# EAGLE design quadcopter-smith (EAGLE 7.2.0)
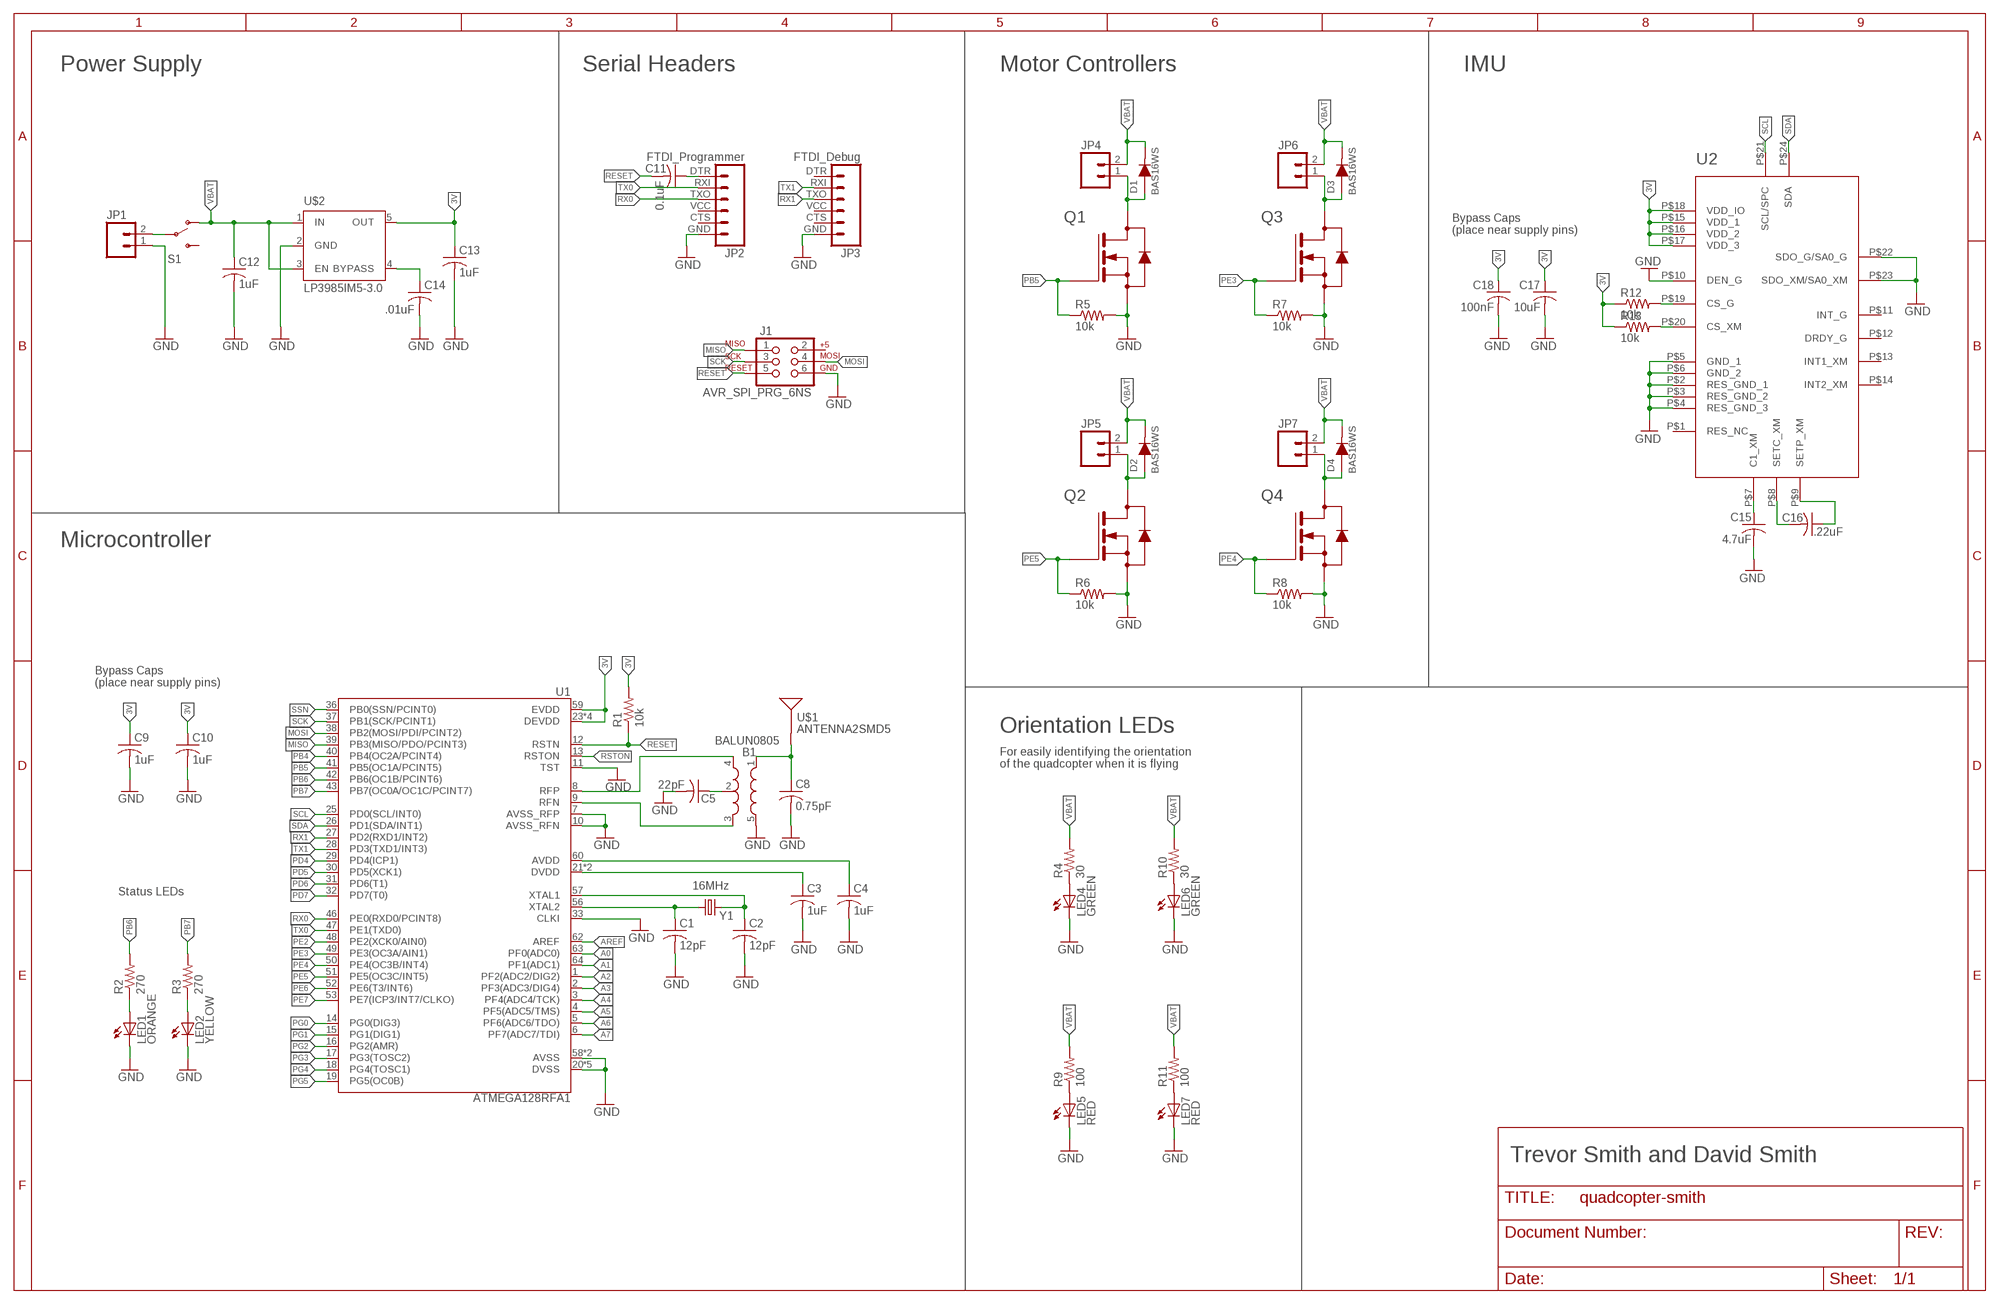
[diagram p0: schematic, sheet 1]

## Parts
B1  BALUN0805  [BALUN]
C1  12pF  C-USC0805  [C0805]
C2  12pF  C-USC0805  [C0805]
C3  1uF  C-USC0805  [C0805]
C4  1uF  C-USC0805  [C0805]
C5  22pF  C-USC0805  [C0805]
C8  0.75pF  C-USC0805  [C0805]
C9  1uF  C-USC0805  [C0805]
C10  1uF  C-USC0805  [C0805]
C11  0.1uF  C-USC0805  [C0805]
C12  1uF  C-USC0805  [C0805]
C13  1uF  C-USC0805  [C0805]
C14  .01uF  C-USC0805  [C0805]
C15  4.7uF  C-USC0805  [C0805]
C16  .22uF  C-USC0805  [C0805]
C17  10uF  C-USC0805  [C0805]
C18  100nF  C-USC0805  [C0805]
D1  BAS16WS  [SOD-323]
D2  BAS16WS  [SOD-323]
D3  BAS16WS  [SOD-323]
D4  BAS16WS  [SOD-323]
J1  AVR_SPI_PRG_6NS  [2X3-NS]
JP1  M02PTH  [1X02]
JP2  FTDI_Programmer  FTDI_BASICPTH  [FTDI_BASIC]
JP3  FTDI_Debug  FTDI_BASICPTH  [FTDI_BASIC]
JP4  M02PTH  [1X02]
JP5  M02PTH  [1X02]
JP6  M02PTH  [1X02]
JP7  M02PTH  [1X02]
LED1  ORANGE  LEDCHIP-LED0805  [CHIP-LED0805]
LED2  YELLOW  LEDCHIP-LED0805  [CHIP-LED0805]
LED4  GREEN  LEDCHIP-LED0805  [CHIP-LED0805]
LED5  RED  LEDCHIP-LED0805  [CHIP-LED0805]
LED6  GREEN  LEDCHIP-LED0805  [CHIP-LED0805]
LED7  RED  LEDCHIP-LED0805  [CHIP-LED0805]
Q1  SI2302CDS  [SOT-23]
Q2  SI2302CDS  [SOT-23]
Q3  SI2302CDS  [SOT-23]
Q4  SI2302CDS  [SOT-23]
R1  10k  R-US_R0805  [R0805]
R2  270  R-US_R0805  [R0805]
R3  270  R-US_R0805  [R0805]
R4  30  R-US_R0805  [R0805]
R5  10k  R-US_R0805  [R0805]
R6  10k  R-US_R0805  [R0805]
R7  10k  R-US_R0805  [R0805]
R8  10k  R-US_R0805  [R0805]
R9  100  R-US_R0805  [R0805]
R10  30  R-US_R0805  [R0805]
R11  100  R-US_R0805  [R0805]
R12  10k  R-US_R0805  [R0805]
R13  10k  R-US_R0805  [R0805]
S1  SWITCH-SPDTPTH  [SWITCH-SPDT]
U1  ATMEGA128RFA1  [QFN-64]
U2  LSM9DS0-LGA24  [LGA-24]
U$1  ANTENNA2SMD5  [ANTENNA-CHIP5]
U$2  LP3985IM5-3.0  [SOT23-DBV]
Y1  16MHz  CRYSTAL5X3  [CRYSTAL-SMD-5X3]

## Nets
3V: C9.1 C10.1 C13.1 C17.1 C18.1 R1.2 R12.1 R13.1 U1.23(DEVDD) U1.34(DEVDD) U1.44(DEVDD) U1.54(DEVDD) U1.59(EVDD) U2.P$15(VDD_1) U2.P$16(VDD_2) U2.P$17(VDD_3) U2.P$18(VDD_IO) U$2.5(OUT)
A0: U1.63(PF0(ADC0))
A1: U1.64(PF1(ADC1))
A2: U1.1(PF2(ADC2/DIG2))
A3: U1.2(PF3(ADC3/DIG4))
A4: U1.3(PF4(ADC4/TCK))
A5: U1.4(PF5(ADC5/TMS))
A6: U1.5(PF6(ADC6/TDO))
A7: U1.6(PF7(ADC7/TDI))
AREF: U1.62(AREF)
GND: B1.5(GND) C1.2 C2.2 C3.2 C4.2 C5.2 C8.2 C9.2 C10.2 C12.2 C13.2 C14.2 C15.2 C17.2 C18.2 J1.6 JP1.1 JP2.GND JP3.GND LED1.C LED2.C LED4.C LED5.C LED6.C LED7.C Q1.P$2(S) Q2.P$2(S) Q3.P$2(S) Q4.P$2(S) R5.2 R6.2 R7.2 R8.2 U1.7(AVSS_RFP) U1.10(AVSS_RFN) U1.11(TST) U1.20(DVSS) U1.24(DVSS) U1.33(CLKI) U1.35(DVSS) U1.45(DVSS) U1.55(DVSS) U1.58(AVSS) U1.61(AVSS) U2.P$2(RES_GND_1) U2.P$3(RES_GND_2) U2.P$4(RES_GND_3) U2.P$5(GND_1) U2.P$6(GND_2) U2.P$10(DEN_G) U2.P$22(SDO_G/SA0_G) U2.P$23(SDO_XM/SA0_XM) U$2.2(GND)
MISO: J1.1 U1.39(PB3(MISO/PDO/PCINT3))
MOSI: J1.4 U1.38(PB2(MOSI/PDI/PCINT2))
N$1: C1.1 U1.56(XTAL2) Y1.1
N$2: C2.1 U1.57(XTAL1) Y1.3
N$3: C3.1 U1.21(DVDD) U1.22(DVDD)
N$4: C4.1 U1.60(AVDD)
N$5: B1.3(OUT2) U1.9(RFN)
N$6: B1.4(OUT1) U1.8(RFP)
N$9: B1.1(IN) C8.1 U$1.FEED(SIGNAL)
N$10: B1.2(GND) C5.1
N$11 [VBAT]: D2.P$1 JP5.1 Q2.P$3(D)
N$12: LED1.A R2.1
N$13: LED2.A R3.1
N$14: LED4.A R4.1
N$15: C11.1 JP2.DTR
N$16: C14.1 U$2.4(BYPASS)
N$17: JP1.2 S1.2(P)
N$18: D1.P$1 JP4.1 Q1.P$3(D)
N$19: D3.P$1 JP6.1 Q3.P$3(D)
N$20: D4.P$1 JP7.1 Q4.P$3(D)
N$21: C16.1 U2.P$9(SETP_XM)
N$22: C16.2 U2.P$8(SETC_XM)
N$23: C15.1 U2.P$7(C1_XM)
N$24: LED6.A R10.1
N$25: LED5.A R9.1
N$26: LED7.A R11.1
N$27: R12.2 U2.P$19(CS_G)
N$28: R13.2 U2.P$20(CS_XM)
PB4: U1.40(PB4(OC2A/PCINT4))
PB5: Q1.P$1(G) R5.1 U1.41(PB5(OC1A/PCINT5))
PB6: R2.2 U1.42(PB6(OC1B/PCINT6))
PB7: R3.2 U1.43(PB7(OC0A/OC1C/PCINT7))
PD4: U1.29(PD4(ICP1))
PD5: U1.30(PD5(XCK1))
PD6: U1.31(PD6(T1))
PD7: U1.32(PD7(T0))
PE2: U1.48(PE2(XCK0/AIN0))
PE3: Q3.P$1(G) R7.1 U1.49(PE3(OC3A/AIN1))
PE4: Q4.P$1(G) R8.1 U1.50(PE4(OC3B/INT4))
PE5: Q2.P$1(G) R6.1 U1.51(PE5(OC3C/INT5))
PE6: U1.52(PE6(T3/INT6))
PE7: U1.53(PE7(ICP3/INT7/CLKO))
PG0: U1.14(PG0(DIG3))
PG1: U1.15(PG1(DIG1))
PG2: U1.16(PG2(AMR))
PG3: U1.17(PG3(TOSC2))
PG4: U1.18(PG4(TOSC1))
PG5: U1.19(PG5(OC0B))
RESET: C11.2 J1.5 R1.1 U1.12(RSTN)
RSTON: U1.13(RSTON)
RX0: JP2.TXO U1.46(PE0(RXD0/PCINT8))
RX1: JP3.TXO U1.27(PD2(RXD1/INT2))
SCK: J1.3 U1.37(PB1(SCK/PCINT1))
SCL: U1.25(PD0(SCL/INT0)) U2.P$21(SCL/SPC)
SDA: U1.26(PD1(SDA/INT1)) U2.P$24(SDA)
SSN: U1.36(PB0(SSN/PCINT0))
TX0: JP2.RXI U1.47(PE1(TXD0))
TX1: JP3.RXI U1.28(PD3(TXD1/INT3))
VBAT [VBAT]: C12.1 D1.P$2 D2.P$2 D3.P$2 D4.P$2 JP4.2 JP5.2 JP6.2 JP7.2 R4.2 R9.2 R10.2 R11.2 S1.1(O) U$2.1(IN) U$2.3(EN)
Unconnected: J1.2 JP2.CTS JP2.VCC JP3.CTS JP3.DTR JP3.VCC S1.3(S) U2.P$1(RES_NC) U2.P$11(INT_G) U2.P$12(DRDY_G) U2.P$13(INT1_XM) U2.P$14(INT2_XM)

## Notes on the sheet
- Power Supply | Serial Headers | Motor Controllers | IMU
- Bypass Caps
  (place near supply pins)
- Microcontroller
- Bypass Caps
  (place near supply pins)
- Orientation LEDs
- For easily identifying the orientation
  of the quadcopter when it is flying
- Status LEDs
- Trevor Smith and David Smith

## Library data of the parts
B1 = Lab5:BALUN: 0805 footprint balun- Ember 351/357
C1-C5 C8-C18 = Lab5:C-US: CAPACITOR, American symbol
D1-D4 = Trevor-lab4:BAS16WS; CREATOR: Trevor Smith; DIST: Digikey; DISTPN: BAS16WS-E3-08CT-ND
J1 = Lab5:AVR_SPI_PRG_6: AVR ISP 6 Pin This is the reduced ISP connector for AVR programming. Common on Arduino. This footprint will take up less PCB space and can be used with a 10-pin to 6-pin adapter such as SKU: BOB-08508
JP1 JP4-JP7 = Lab5:M02: Header 2 Standard 2-pin 0.1" header. Use with straight break away headers (SKU : PRT-00116), right angle break away headers (PRT-00553), swiss pins (PRT-00743), machine pins (PRT-00117), and female headers (PRT-00115). Molex polarized connector foot print use with SKU : PRT-08233 with associated crimp pins and housings.
JP2 JP3 = Lab5:FTDI_BASIC: FTDI Basic header with labels
LED1 LED2 LED4-LED7 = Lab5:LED: LED OSRAM: - CHIPLED LG R971, LG N971, LY N971, LG Q971, LY Q971, LO R971, LY R971 LH N974, LH R974 LS Q976, LO Q976, LY Q976 LO Q996 - Hyper CHIPLED LW Q18S LB Q993, LB Q99A, LB R99A - SideLED LS A670, LO A670, LY A670, LG A670, LP A670 LB A673, LV A673, LT A673, LW A673 LH A674 LY A675 LS A676, LA A676, LO A676, LY A676, LW A676 LS A679, LY A679, LG A679 - Hyper Micro SIDELED® LS Y876, LA Y876, LO Y876, LY Y876 LT Y87S - SmartLED LW L88C, LW L88S LB L89C, LB L89S, LG L890 LS L89K, LO L89K, LY L89K LS L896, LA L896, LO L896, LY L896 - TOPLED LS T670, LO T670, LY T670, LG T670, LP T670 LSG T670, LSP T670, LSY T670, LOP T670, LYG T670 LG T671, LOG T671, LSG T671 LB T673, LV T673, LT T673, LW T673 LH T674 LS T676, LA T676, LO T676, LY T676, LB T676, LH T676, LSB T676, LW T676 LB T67C, LV T67C, LT T67C, LS T67K, LO T67K, LY T67K, LW E67C LS E67B, LA E67B, LO E67B, LY E67B, LB E67C, LV E67C, LT E67C LW T67C LS T679, LY T679, LG T679 LS T770, LO T770, LY T770, LG T770, LP T770 LB T773, LV T773, LT T773, LW T773 LH T774 LS E675, LA E675, LY E675, LS T675 LS T776, LA T776, LO T776, LY T776, LB T776 LHGB T686 LT T68C, LB T68C - Hyper Mini TOPLED® LB M676 - Mini TOPLED Santana® LG M470 LS M47K, LO M47K, LY M47K Source: http://www.osram.convergy.de LUXEON: - LUMILED® LXK2-PW12-R00, LXK2-PW12-S00, LXK2-PW14-U00, LXK2-PW14-V00 LXK2-PM12-R00, LXK2-PM12-S00, LXK2-PM14-U00 LXK2-PE12-Q00, LXK2-PE12-R00, LXK2-PE12-S00, LXK2-PE14-T00, LXK2-PE14-U00 LXK2-PB12-K00, LXK2-PB12-L00, LXK2-PB12-M00, LXK2-PB14-N00, LXK2-PB14-P00, LXK2-PB14-Q00 LXK2-PR12-L00, LXK2-PR12-M00, LXK2-PR14-Q00, LXK2-PR14-R00 LXK2-PD12-Q00, LXK2-PD12-R00, LXK2-PD12-S00 LXK2-PH12-R00, LXK2-PH12-S00 LXK2-PL12-P00, LXK2-PL12-Q00, LXK2-PL12-R00 Source: www.luxeon.com KINGBRIGHT: KA-3528ASYC Source: www.kingbright.com
Q1-Q4 = Trevor-lab4:SI2302CDS; CREATOR: Trevor Smith; DIST: Digikey; DISTPN: SI2302CDS-T1-E3
R1-R13 = Lab5:R-US_: RESISTOR, American symbol
S1 = Lab5:SWITCH-SPDT: SPDT Switch Simple slide switch, Spark Fun Electronics SKU : COM-00102 DPDT SMT slide switch, AYZ0202, SWCH-08179; PROD_ID: SWCH-08261
U1 = Lab5:ATMEGA128RFA1: ATmega128RFA1 8-bit AVR Microcontroller with Low Power 2.4GHz Transceiver for ZigBee and IEEE 802.15.4
U2 = Trevor-lab4:LSM9DS0; CREATOR: Trevor Smith; DIST: Digikey; DISTPN: 497-13902-1-ND
U$1 = Lab5:ANTENNA2: Chip antenna Single endded antenna. Common with smaller chip antennas. CHIP4 package is the GPS Chip Antenna SKU: GPS-08418. CHIP5 package is 2.4GHz chip antenna SKU: WRL-00144.
U$2 = Lab5:LP3985IM5-3.0
Y1 = Lab5:CRYSTAL: Various standard crystals. Proven footprints. Spark Fun Electronics SKU : COM-00534

## Net classes
1 VBAT: width 0.457 mm, drill 0.457 mm
2 ANTENNA: width 0.457 mm, drill 0.457 mm

## Board
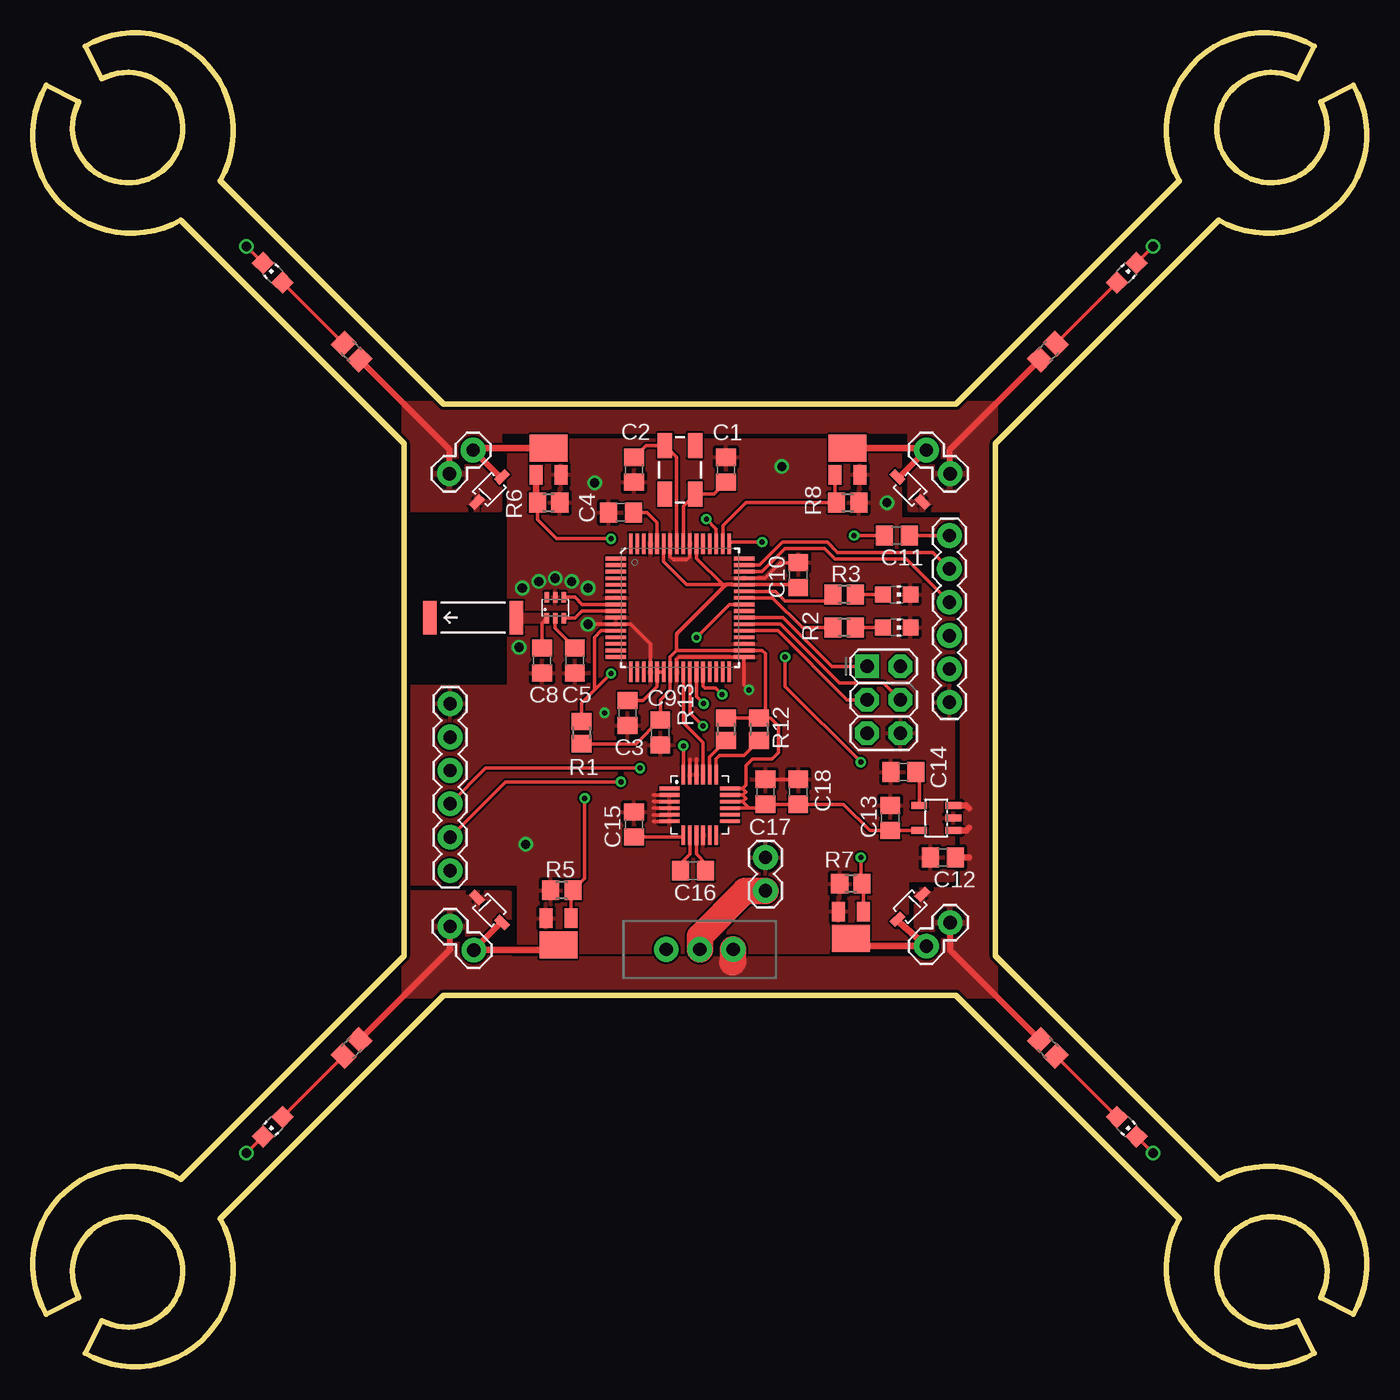
[diagram p1: board, top side]
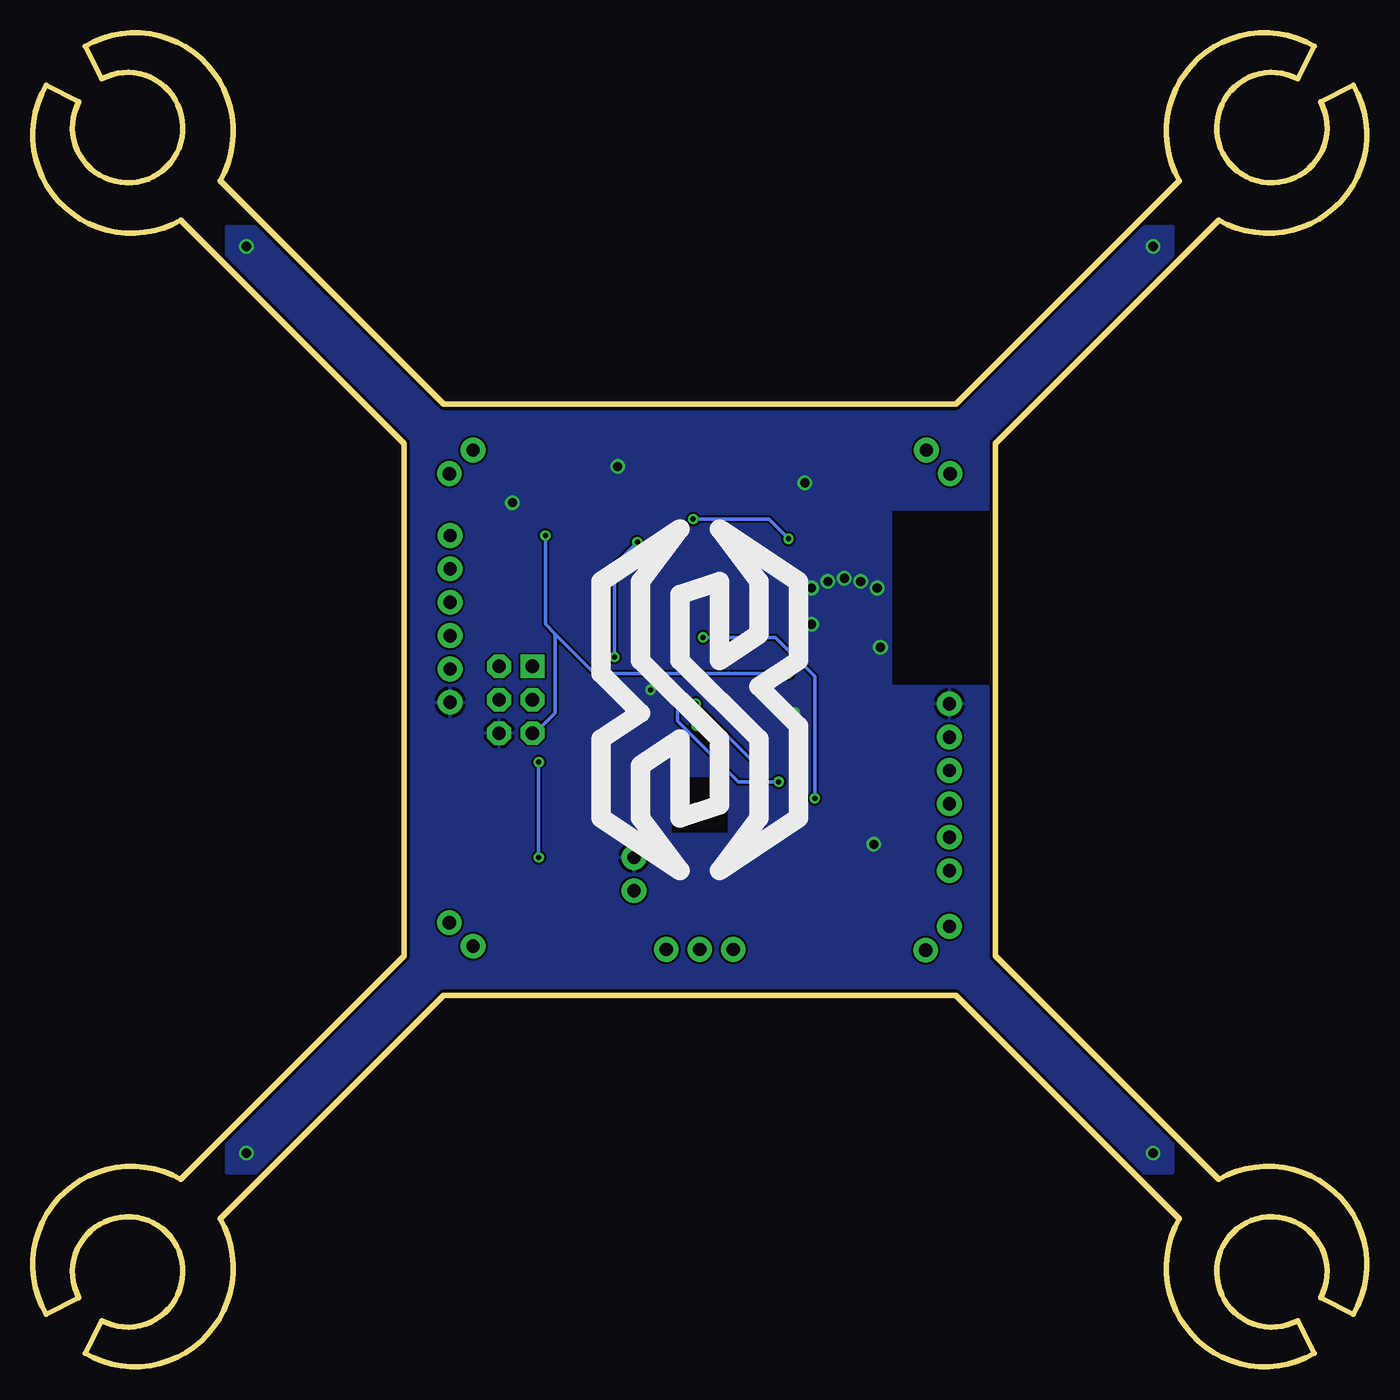
[diagram p2: board, bottom side, seen from below]

Size 101.5 x 101.5 mm. Coordinates in mm from the lower left corner, seen from the top.
Outline: 28.25,70.25 28.25,31.25 11.25,14.25 arc150 1,4 3.5,5.25 arc-326 5.25,3.5 4,1 arc150 14.25,11.25 31.25,28.25 70.25,28.25 87.25,11.25 arc150 97.5,1 96.25,3.5 arc-326 98,5.25 100.5,4 arc150 90.25,14.25 73.25,31.25 73.25,70.25 90.25,87.25 arc150 100.5,97.5 98,96.25 arc-326 96.25,98 97.5,100.5 arc150 87.25,90.25 70.25,73.25 31.25,73.25 14.25,90.25 arc150 4,100.5 5.25,98 arc-326 3.5,96.25 1,97.5 arc150 11.25,87.25 28.25,70.25
Copper layers (1*16): Top 0.035559375mm / dielectric 1.501140625mm / Bottom 0.035559375mm
Design rules "4pcb-33board": minimum track width 6mil, minimum drill 15mil, track to track 6mil, track to pad 6mil, pad to pad 6mil, via to via 6mil, smd to smd 6mil, copper to edge 10mil, drill to drill 10mil, minimum pad ring 10mil, minimum via ring 8mil, stop-mask expansion 4mil, vias tented up to drill 0mil, thermal gap 10mil
tRestrict: area 48.6,40.6 to 52.8,44.8
bRestrict: area 48.6,40.6 to 52.8,44.8

### Footprints (pad centres in the part's own frame; a part is rotated, then mirrored left to right if it is on the bottom)
BALUN = smd 0.35 x 0.8: 1 -0.65,-0.8; 2 0,-0.8; 3 0.65,-0.8; 4 0.65,0.8; 5 0,0.8; 6 -0.65,0.8
C0805 = smd 1.3 x 1.5: 1 -0.95,0; 2 0.95,0
SOD-323 = smd 1.1 x 0.6: P$1 -1.35,0; P$2 1.35,0
2X3-NS = drill 1.016 pad 1.803 square: 1 -2.54,-1.27 | drill 1.016 pad 1.803 octagon: 2 -2.54,1.27; 3 0,-1.27; 4 0,1.27; 5 2.54,-1.27; 6 2.54,1.27
1X02 = drill 1.016 pad 1.88: 1 0,0; 2 2.54,0
FTDI_BASIC = drill 1.016 pad 1.88: CTS 10.16,0; DTR 0,0; GND 12.7,0; RXI 2.54,0; TXO 5.08,0; VCC 7.62,0
CHIP-LED0805 = smd 1.2 x 1.2: A 0,-1.05; C 0,1.05
SOT-23 = smd 1 x 1.5: P$1 -0.95,-0.875; P$2 0.95,-0.875 | smd 2.9 x 2.05: P$3 0,1.15
R0805 = smd 1.3 x 1.5: 1 -0.85,0; 2 0.85,0
SWITCH-SPDT = drill 1.016 pad 1.88: 1 0,2.54; 2 0,0; 3 0,-2.54
QFN-64 = smd 1.562 x 0.28: 1 -4.881,3.75; 2 -4.881,3.25; 3 -4.881,2.75; 4 -4.881,2.25; 5 -4.881,1.75; 6 -4.881,1.25; 7 -4.881,0.75; 8 -4.881,0.25; 9 -4.881,-0.25; 10 -4.881,-0.75; 11 -4.881,-1.25; 12 -4.881,-1.75; 13 -4.881,-2.25; 14 -4.881,-2.75; 15 -4.881,-3.25; 16 -4.881,-3.75; 33 4.881,-3.75; 34 4.881,-3.25; 35 4.881,-2.75; 36 4.881,-2.25; 37 4.881,-1.75; 38 4.881,-1.25; 39 4.881,-0.75; 40 4.881,-0.25; 41 4.881,0.25; 42 4.881,0.75; 43 4.881,1.25; 44 4.881,1.75; 45 4.881,2.25; 46 4.881,2.75; 47 4.881,3.25; 48 4.881,3.75 | smd 0.28 x 1.562: 17 -3.75,-4.881; 18 -3.25,-4.881; 19 -2.75,-4.881; 20 -2.25,-4.881; 21 -1.75,-4.881; 22 -1.25,-4.881; 23 -0.75,-4.881; 24 -0.25,-4.881; 25 0.25,-4.881; 26 0.75,-4.881; 27 1.25,-4.881; 28 1.75,-4.881; 29 2.25,-4.881; 30 2.75,-4.881; 31 3.25,-4.881; 32 3.75,-4.881; 49 3.75,4.881; 50 3.25,4.881; 51 2.75,4.881; 52 2.25,4.881; 53 1.75,4.881; 54 1.25,4.881; 55 0.75,4.881; 56 0.25,4.881; 57 -0.25,4.881; 58 -0.75,4.881; 59 -1.25,4.881; 60 -1.75,4.881; 61 -2.25,4.881; 62 -2.75,4.881; 63 -3.25,4.881; 64 -3.75,4.881
LGA-24 = smd 1.5 x 0.28: P$1 -2.3,1.25; P$2 -2.3,0.75; P$3 -2.3,0.25; P$4 -2.3,-0.25; P$5 -2.3,-0.75; P$6 -2.3,-1.25; P$13 2.3,-1.25; P$14 2.3,-0.75; P$15 2.3,-0.25; P$16 2.3,0.25; P$17 2.3,0.75; P$18 2.3,1.25 | smd 0.28 x 1.5: P$7 -1.25,-2.3; P$8 -0.75,-2.3; P$9 -0.25,-2.3; P$10 0.25,-2.3; P$11 0.75,-2.3; P$12 1.25,-2.3; P$19 1.25,2.3; P$20 0.75,2.3; P$21 0.25,2.3; P$22 -0.25,2.3; P$23 -0.75,2.3; P$24 -1.25,2.3
ANTENNA-CHIP5 = smd 1.016 x 2.54: FEED -3.302,0; NC 3.302,0
SOT23-DBV = smd 0.55 x 1.2: 1 -0.95,-1.3; 2 0,-1.3; 3 0.95,-1.3; 4 0.95,1.3; 5 -0.95,1.3
CRYSTAL-SMD-5X3 = smd 1.9 x 1.1: 1 -1.85,-1.15; 2 1.85,-1.15; 3 1.85,1.15; 4 -1.85,1.15

### Placement (x,y rotation side)
B1  39.75,57.75 0 top
C1  52.75,68.25 90 top
C2  45.75,68.25 270 top
C3  45.25,49.75 270 top
C4  44.75,65 180 top
C5  41.25,53.75 270 top
C8  38.75,53.75 270 top
C9  47.75,48.25 270 top
C10  58.25,60.25 90 top
C11  65.75,63.25 180 top
C12  69.25,38.75 180 top
C13  65.25,41.75 90 top
C14  66.25,45.25 180 top
C15  45.75,41.25 90 top
C16  50.25,37.75 180 top
C17  55.75,43.75 90 top
C18  58.25,43.75 90 top
D1  34.75,34.75 135 top
D2  34.75,66.75 225 top
D3  66.75,35 45 top
D4  66.75,66.75 315 top
J1  64.75,50.75 270 top
JP1  55.75,38.75 270 top
JP2  69.75,63.25 270 top
JP3  31.75,37.75 90 top
JP4  33.55,31.7 135 top
JP5  33.5,69.75 225 top
JP6  68,32 45 top
JP7  68,69.75 315 top
LED1  65.75,56.25 270 top
LED2  65.75,58.75 270 top
LED4  18.25,83.25 45 top
LED5  18.25,18.25 135 top
LED6  83.25,83.25 315 top
LED7  83.25,18.25 225 top
Q1  40,33.25 180 top
Q2  39.25,68.75 0 top
Q3  62.25,33.75 180 top
Q4  62,68.75 0 top
R1  41.75,48.25 270 top
R2  61.75,56.25 180 top
R3  61.75,58.75 180 top
R4  24.25,77.25 315 top
R5  40.25,36.25 180 top
R6  39.25,65.75 0 top
R7  62.25,36.75 180 top
R8  62,65.75 0 top
R9  24.25,24.25 45 top
R10  77.25,77.25 225 top
R11  77.25,24.25 135 top
R12  55.25,48.5 270 top
R13  52.75,48.5 270 top
S1  50.75,31.75 270 top
U1  49.25,57.75 0 top
U2  50.75,42.75 0 top
U$1  33.5,57 180 top
U$2  68.75,41.75 90 top
U$3  [LOGO]  50.75,50.75 0 bottom
Y1  49.25,68.25 90 top

### Tracks (layer width: path | path; a pad name or v marks a point on that pad's centre or on a via)
3V
  Top 0.28: C10.1 58.05,59.5 U1.44 53.25,59.5 52.5,59.5 | U2.P$15 54.5,42.5 | 54.5,42.5 55.45,42.5 C17.1 C18.1 61.7,42.8 63.7,40.8 C13.1 U$2.5 | 55.75,49.35 R12.1 R13.1 | 55.75,49.35 56.15,49.35 56.75,48.75 56.75,46.75 56.25,46.25 54.75,46.25 54.25,45.75 54.25,44.25 54,44 | 52.5,59.5 49.75,59.5 48,61.25 U1.59 | U1.54 50.5,61.5 52.5,59.5 | 49,54.5 U1.34 55.5,54.5 55.75,54.25 55.75,49.35 | 49,54.5 48.5,54 U1.23 48.5,51.5 47.75,50.75 C9.1 47.7,49.2 45.9,47.4 R1.2 | 49,55.75 49,54.5 | U2.P$18 54,44 | 54,44 54.25,43.75 54,43.5 | U2.P$17 54,43.5 | 54,43.5 54.25,43.25 54,43 | U2.P$16 54,43 | 54,43 54.5,42.5
  Top 0.3: 53.25,59.5 52.75,59.5 49,55.75
GND  (via drill 0.38, 0.7)
  Top 0.28: LED4.C v16.25,85.25 | LED6.C v85.25,85.25 | LED5.C v16.25,16.25 | LED7.C v85.25,16.25 | U1.45 55.7,60 56.85,61.15 58.2,61.15 | C17.2 C18.2 | v42.25,56.5 U1.11 45.5,56.5 47,55 U1.20 | v54.5,51.5 54.13,51.87 U1.33 49.2,54 49,53.8 U1.24 | U1.58 48.5,61.65 48.75,61.4 49.75,61.4 50,61.65 U1.55 | U2.P$23 50,46.25 | U2.P$22 50.5,46.25 | U2.P$2 47.25,43.5 | U2.P$3 47.25,43 | U2.P$4 47.25,42.5 | U2.P$5 47.25,42 | U2.P$6 47.25,41.5
  other vias: 39.75,60 41,59.75 38.5,59.75 37.25,59.25 42.25,59.25 37,54.75 43.5,49.75 42.75,67.25 57,68.5 37.5,39.75 65,65.75
  pour Bottom: 14.75,86.75 86.75,86.75 86.75,14.75 14.75,14.75 14.75,51.75 36.25,51.75 36.25,65.25 14.75,65.25
  pour Top (rank 2): 36.25,70.5 66,70.5 66,64.5 70,64.5 70,37 66.5,37 66.5,31.5 37,31.5 37,36.75 28.25,36.75 28.25,51.75 36.25,51.75
MISO
  Top 0.28: U1.39 57.1,57 60.81,53.29 J1.1
MOSI
  Top 0.28: U1.38 56.9,56.5 61.37,52.02 64.74,52.02 J1.4
N$1
  Top 0.28: U1.56 49.5,65.5 Y1.1 51.85,66.4 C1.1
N$2
  Top 0.28: U1.57 49,69.2 Y1.3 46.65,70.1 C2.1
N$3
  Top 0.28: C3.1 46.45,50.7 47.5,51.75 U1.21 U1.22
N$4
  Top 0.28: U1.60 47.5,64.25 46.75,65 C4.1
N$5
  Top 0.28: U1.9 41.8,57.5 41.25,56.95 B1.3
N$6
  Top 0.28: U1.8 41.8,58 41.25,58.55 B1.4
N$9
  Top 0.28: C8.1 38.75,56.6 B1.1
  pour Top (no thermals): 39.15,57.25 39.15,56.65 36.55,56.65 36.55,57.25
N$10
  Top 0.28: B1.2 39.75,56.2 C5.1
N$11
  Top 0.5: D2.P$1 35.54,67.7 JP5.1 33.65,69.9 Q2.P$3
N$12
  Top 0.28: R2.1 LED1.A
N$13
  Top 0.28: R3.1 LED2.A
N$14
  Top 0.28: R4.1 LED4.A
N$15
  Top 0.28: C11.1 JP2.DTR
N$16
  Top 0.28: U$2.4 67.45,45 C14.1
N$17
  Top 2: S1.2 50.75,32.75 54.21,36.21 JP1.2
N$18
  Top 0.5: D1.P$1 35.64,33.79 JP4.1 38.85,31.7 Q1.P$3
N$19
  Top 0.5: D3.P$1 65.95,33.79 JP6.1 62.6,32 Q3.P$3
N$20
  Top 0.5: D4.P$1 65.95,67.7 JP7.1 67.85,69.9 Q4.P$3
N$21
  Top 0.28: C16.1 51.2,38.3 50.5,39 U2.P$9
N$22
  Top 0.28: C16.2 49.3,38.3 50,39 U2.P$8
N$23
  Top 0.28: C15.1 49.35,40.3 U2.P$7
N$24
  Top 0.28: R10.1 LED6.A
N$25
  Top 0.28: LED5.A R9.1
N$26
  Top 0.28: R11.1 LED7.A
N$27
  Top 0.28: U2.P$19 52,46.25 52.25,46.5 54.1,46.5 R12.2
N$28
  Top 0.28: U2.P$20 51.5,46.4 R13.2
PB5  (via drill 0.38)
  Top 0.28: Q1.P$1 40.95,35.9 R5.1 42,37.15 v42,43.25 | U1.41 53,58 v50.5,55.5
  Bottom 0.28: v50.5,55.5 45,55.5 42,52.5 v42,43.25
PB6
  Top 0.28: U1.42 56.3,58.5 58.55,56.25 R2.2
PB7
  Top 0.28: U1.43 56.5,59 57.25,58.25 60.4,58.25 R3.2
PE3  (via drill 0.38)
  Top 0.28: Q3.P$1 63.2,36.15 R7.1 63,36.35 v63,38.75 | v57.25,54 57.25,51.75 v63,46 | v55.5,62.75 53.12,62.75 U1.49
  Bottom 0.28: v55.5,62.75 57.25,61 v57.25,54 | v63,46 v63,38.75
PE4
  Top 0.28: U1.50 52.5,64 54.25,65.75 R8.1 61.05,65.85 Q4.P$1
PE5  (via drill 0.38)
  Top 0.28: 38.3,65.85 R6.1 38.4,64.45 39.85,63 v44,63 | U1.51 52,63.75 v51.25,64.5
  Top 0.5: 38.3,65.85 Q2.P$1
  Bottom 0.28: v51.25,64.5 45.5,64.5 v44,63
RESET  (via drill 0.38)
  Top 0.28: U1.12 43.25,56 42.75,55.5 42.75,51.5 | R1.1 41.75,50.5 42.75,51.5 | C11.2 v62.5,63.25 | v44,52.75 42.75,51.5
  Bottom 0.28: v62.5,63.25 62.5,56.5 61.75,55.75 | 61.75,55.75 61.75,49.75 63.29,48.21 J1.5 | 61.75,55.75 58.75,52.75 v44,52.75
RX0
  Top 0.28: U1.46 55.5,60.5 57.25,62.25 60.25,62.25 61.05,61.45 66.47,61.45 JP2.TXO
RX1  (via drill 0.38)
  Top 0.28: U1.27 50.5,51 v51.05,50.45 | v46.2,45.55 34.45,45.55 JP3.TXO
  Bottom 0.28: v51.05,50.45 51.05,50.4 v46.2,45.55
SCK
  Top 0.28: U1.37 56.7,56 61.95,50.75 J1.3
SCL
  Top 0.28: U1.25 49.5,49 51,47.5 U2.P$21
SDA  (via drill 0.38, 0.38 pad 0.38)
  Top 0.28: U1.26 50,49.75 v51,48.75 | U2.P$24 v49.5,47.25
  Bottom 0.28: v51,48.75 v49.5,47.25
TX0
  Top 0.28: U1.47 55.3,61 57.05,62.75 60.45,62.75 61.24,61.96 68.5,61.96 JP2.RXI
TX1  (via drill 0.38)
  Top 0.28: U1.28 51,51.8 51.15,51.65 51.95,51.65 v52.45,51.15 | v44.75,44.5 35.96,44.5 JP3.RXI
  Bottom 0.28: v52.45,51.15 52.45,49.15 47.8,44.5 v44.75,44.5
VBAT
  Top 0.457: JP6.2 69.8,31.7 R11.2 | JP7.2 69.8,69.8 R10.2 | JP5.2 31.7,69.8 R4.2 | R9.2 31.75,31.75 JP4.2 | 71.05,42.7 71.25,42.5 | 71.05,40.8 71.25,41
  Top 0.5: U$2.3 71.05,42.7 | U$2.1 71.05,40.8 | C12.1 71.25,38.75
  Top 2: S1.1 53.29,30.79 53.25,30.75
  pour Top: 28.25,36 28.25,28.25 73.25,28.25 73.25,73.25 28.25,73.25 28.25,65.25 35.5,65.25 35.5,71.25 66.75,71.25 66.75,65.25 70.75,65.25 70.75,36.25 67.25,36.25 67.25,31 36.25,31 36.25,36